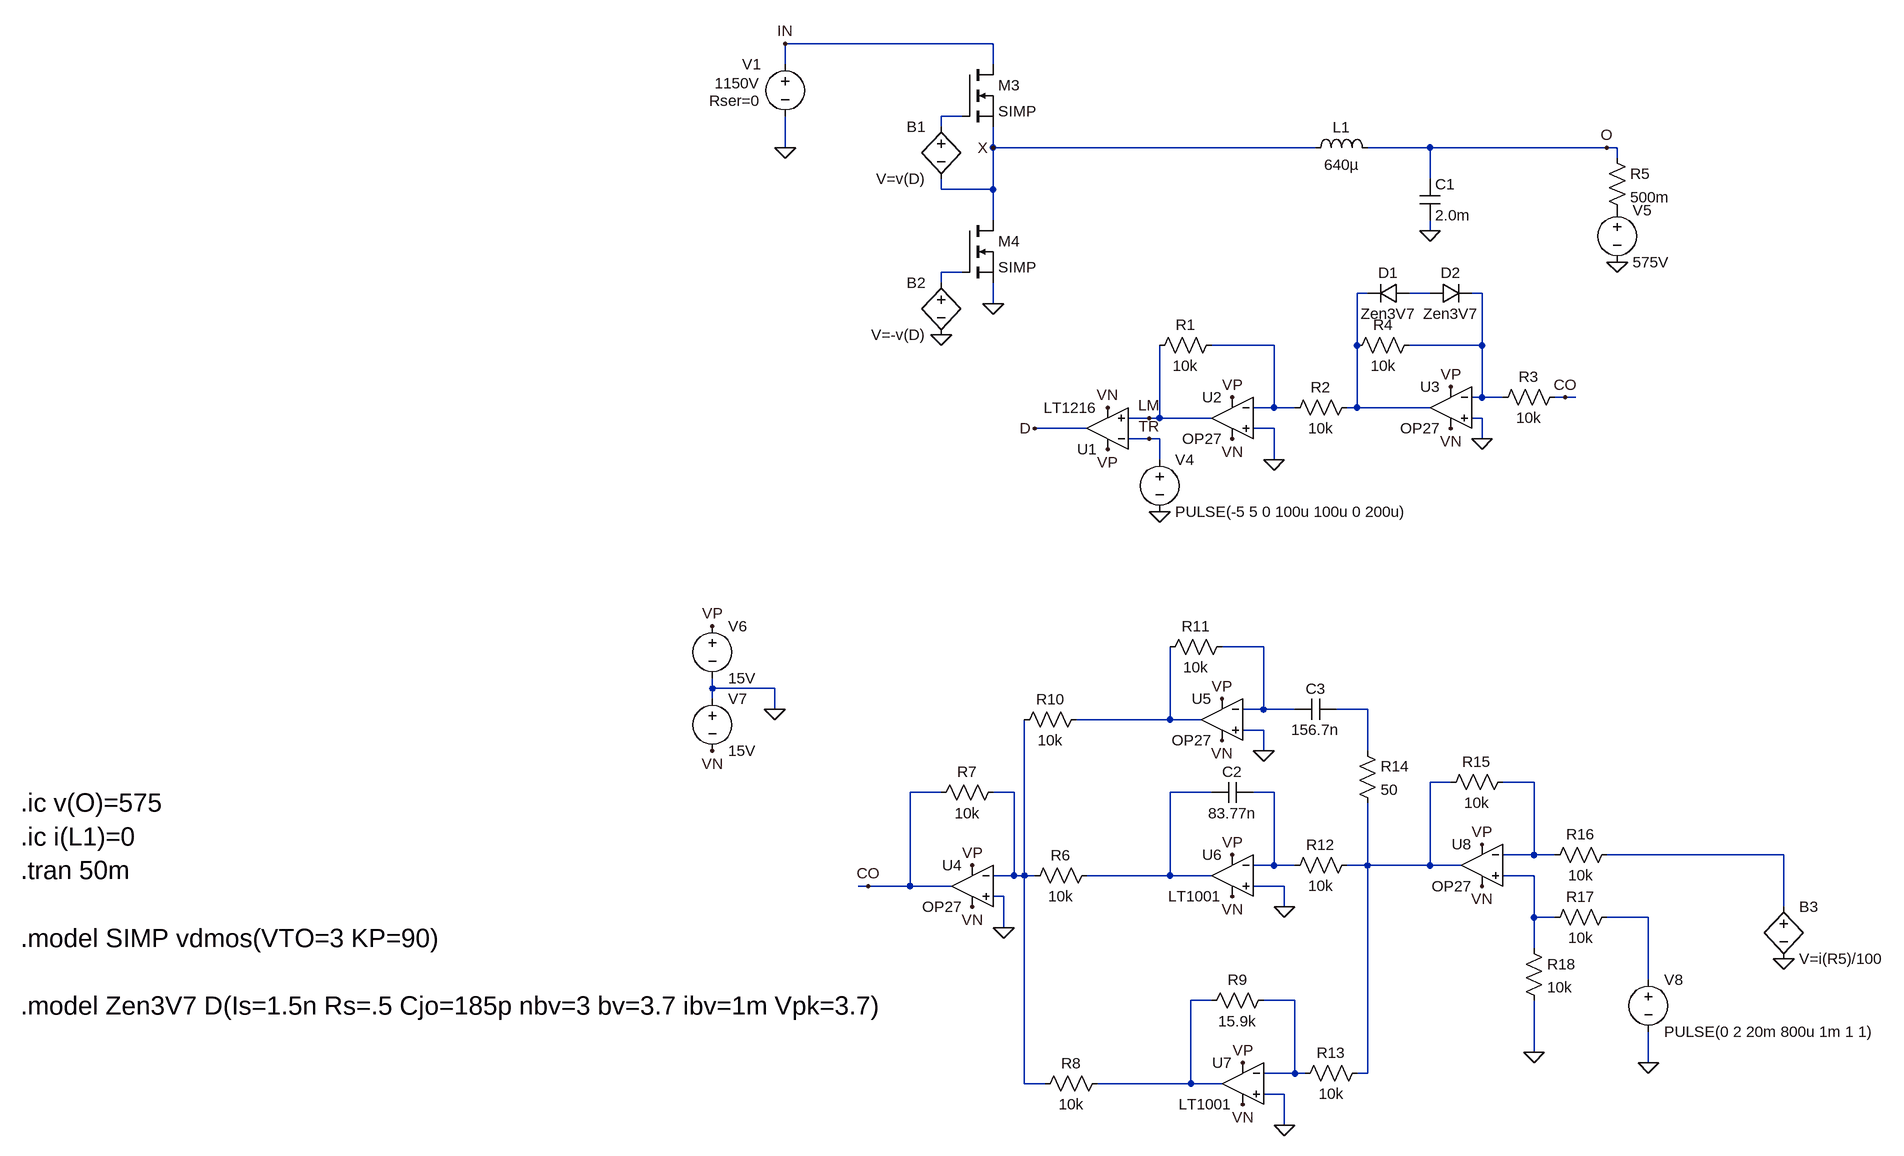
[diagram p0: schematic Analog PID Controller - 575V Pack.asc]
Analog PID Controller - 575V Pack.asc, the LTspice schematic file:
Version 4
SHEET 1 2304 1776
WIRE 704 64 384 64
WIRE 384 96 384 64
WIRE 704 96 704 64
WIRE 656 176 624 176
WIRE 624 192 624 176
WIRE 384 224 384 176
WIRE 704 224 704 192
WIRE 1200 224 704 224
WIRE 1376 224 1280 224
WIRE 1648 224 1376 224
WIRE 1664 224 1648 224
WIRE 1664 240 1664 224
WIRE 1376 272 1376 224
WIRE 624 288 624 272
WIRE 704 288 704 224
WIRE 704 288 624 288
WIRE 704 336 704 288
WIRE 1376 352 1376 336
WIRE 656 416 624 416
WIRE 624 432 624 416
WIRE 1280 448 1264 448
WIRE 1376 448 1344 448
WIRE 1456 448 1440 448
WIRE 704 464 704 432
WIRE 1136 528 1040 528
WIRE 1264 528 1264 448
WIRE 1456 528 1456 448
WIRE 1456 528 1344 528
WIRE 1456 608 1456 528
WIRE 1456 608 1440 608
WIRE 1488 608 1456 608
WIRE 1584 608 1568 608
WIRE 1600 608 1584 608
WIRE 1136 624 1136 528
WIRE 1136 624 1104 624
WIRE 1168 624 1136 624
WIRE 1264 624 1264 528
WIRE 1264 624 1248 624
WIRE 1376 624 1264 624
WIRE 944 640 912 640
WIRE 960 640 960 528
WIRE 960 640 944 640
WIRE 1040 640 960 640
WIRE 1456 640 1440 640
WIRE 848 656 768 656
WIRE 1136 656 1104 656
WIRE 944 672 912 672
WIRE 960 672 944 672
WIRE 1456 672 1456 640
WIRE 960 704 960 672
WIRE 1136 704 1136 656
WIRE 1120 992 1056 992
WIRE 272 1056 272 1040
WIRE 368 1056 272 1056
WIRE 272 1072 272 1056
WIRE 368 1088 368 1056
WIRE 1120 1088 1120 992
WIRE 1120 1088 1088 1088
WIRE 1168 1088 1120 1088
WIRE 1280 1088 1232 1088
WIRE 976 1104 976 992
WIRE 976 1104 832 1104
WIRE 1024 1104 976 1104
WIRE 1120 1120 1088 1120
WIRE 1120 1152 1120 1120
WIRE 1280 1152 1280 1088
WIRE 1408 1200 1376 1200
WIRE 1536 1200 1488 1200
WIRE 624 1216 576 1216
WIRE 736 1216 704 1216
WIRE 1040 1216 976 1216
WIRE 1136 1216 1104 1216
WIRE 1536 1312 1536 1200
WIRE 1536 1312 1488 1312
WIRE 1568 1312 1536 1312
WIRE 1920 1312 1648 1312
WIRE 1136 1328 1136 1216
WIRE 1136 1328 1104 1328
WIRE 1168 1328 1136 1328
WIRE 1280 1328 1280 1232
WIRE 1280 1328 1248 1328
WIRE 1376 1328 1376 1200
WIRE 1376 1328 1280 1328
WIRE 1424 1328 1376 1328
WIRE 736 1344 736 1216
WIRE 736 1344 704 1344
WIRE 752 1344 752 1104
WIRE 752 1344 736 1344
WIRE 768 1344 752 1344
WIRE 976 1344 976 1216
WIRE 976 1344 848 1344
WIRE 1040 1344 976 1344
WIRE 1536 1344 1488 1344
WIRE 512 1360 496 1360
WIRE 576 1360 576 1216
WIRE 576 1360 512 1360
WIRE 640 1360 576 1360
WIRE 1152 1360 1104 1360
WIRE 720 1376 704 1376
WIRE 1152 1392 1152 1360
WIRE 1920 1392 1920 1312
WIRE 1536 1408 1536 1344
WIRE 1568 1408 1536 1408
WIRE 1712 1408 1648 1408
WIRE 720 1424 720 1376
WIRE 1536 1456 1536 1408
WIRE 1712 1504 1712 1408
WIRE 1040 1536 1008 1536
WIRE 1168 1536 1120 1536
WIRE 1536 1616 1536 1536
WIRE 1712 1632 1712 1584
WIRE 1168 1648 1168 1536
WIRE 1168 1648 1120 1648
WIRE 1184 1648 1168 1648
WIRE 1280 1648 1280 1328
WIRE 1280 1648 1264 1648
WIRE 752 1664 752 1344
WIRE 784 1664 752 1664
WIRE 1008 1664 1008 1536
WIRE 1008 1664 864 1664
WIRE 1056 1664 1008 1664
WIRE 1152 1680 1120 1680
WIRE 1152 1728 1152 1680
FLAG 624 512 0
FLAG 704 464 0
FLAG 384 224 0
FLAG 1376 352 0
FLAG 960 784 0
FLAG 1664 400 0
FLAG 1456 672 0
FLAG 880 624 VN
FLAG 1072 672 VN
FLAG 880 688 VP
FLAG 1072 608 VP
FLAG 1408 656 VN
FLAG 1408 592 VP
FLAG 1584 608 CO
FLAG 1648 224 O
FLAG 768 656 D
FLAG 368 1088 0
FLAG 272 960 VP
FLAG 272 1152 VN
FLAG 1120 1152 0
FLAG 1152 1392 0
FLAG 1152 1728 0
FLAG 1920 1472 0
FLAG 1712 1632 0
FLAG 1536 1616 0
FLAG 512 1360 CO
FLAG 1088 1696 VN
FLAG 1072 1376 VN
FLAG 1056 1136 VN
FLAG 1456 1360 VN
FLAG 1072 1312 VP
FLAG 1456 1296 VP
FLAG 1056 1072 VP
FLAG 1088 1632 VP
FLAG 672 1328 VP
FLAG 672 1392 VN
FLAG 704 224 X
FLAG 384 64 IN
FLAG 1136 704 0
FLAG 944 672 TR
FLAG 944 640 LM
FLAG 720 1424 0
DATAFLAG 960 784 ""
SYMBOL voltage 384 80 M0
WINDOW 3 39 45 Left 2
WINDOW 123 0 0 Left 0
WINDOW 39 38 72 Left 2
WINDOW 0 37 16 Left 2
SYMATTR Value 1150V
SYMATTR SpiceLine Rser=0
SYMATTR InstName V1
SYMBOL ind 1184 240 R270
WINDOW 0 32 56 VTop 2
WINDOW 3 5 56 VBottom 2
SYMATTR InstName L1
SYMATTR Value 640µ
SYMBOL cap 1360 272 R0
SYMATTR InstName C1
SYMATTR Value 2.0m
SYMBOL OpAmps\\LT1216 880 720 R180
SYMATTR InstName U1
SYMBOL OpAmps\\OP27 1072 576 M0
SYMATTR InstName U2
SYMBOL res 1056 512 R90
WINDOW 0 0 56 VBottom 2
WINDOW 3 32 56 VTop 2
SYMATTR InstName R1
SYMATTR Value 10k
SYMBOL voltage 960 688 R0
WINDOW 123 0 0 Left 0
WINDOW 39 0 0 Left 0
SYMATTR InstName V4
SYMATTR Value PULSE(-5 5 0 100u 100u 0 200u)
SYMBOL res 1264 608 R90
WINDOW 0 0 56 VBottom 2
WINDOW 3 32 56 VTop 2
SYMATTR InstName R2
SYMATTR Value 10k
SYMBOL OpAmps\\OP27 1408 560 M0
SYMATTR InstName U3
SYMBOL res 1584 592 R90
WINDOW 0 0 56 VBottom 2
WINDOW 3 32 56 VTop 2
SYMATTR InstName R3
SYMATTR Value 10k
SYMBOL res 1360 512 R90
WINDOW 0 0 56 VBottom 2
WINDOW 3 32 56 VTop 2
SYMATTR InstName R4
SYMATTR Value 10k
SYMBOL diode 1344 432 R90
WINDOW 0 0 32 VBottom 2
WINDOW 3 32 32 VTop 2
SYMATTR InstName D1
SYMATTR Value Zen3V7
SYMBOL diode 1376 432 M90
WINDOW 0 0 32 VBottom 2
WINDOW 3 32 32 VTop 2
SYMATTR InstName D2
SYMATTR Value Zen3V7
SYMBOL res 1648 224 R0
SYMATTR InstName R5
SYMATTR Value 500m
SYMBOL voltage 1664 304 R0
WINDOW 123 0 0 Left 0
WINDOW 39 0 0 Left 0
SYMATTR InstName V5
SYMATTR Value 575V
SYMBOL voltage 272 944 R0
WINDOW 123 0 0 Left 0
WINDOW 39 0 0 Left 0
SYMATTR InstName V6
SYMATTR Value 15V
SYMBOL voltage 272 1056 R0
WINDOW 123 0 0 Left 0
WINDOW 39 0 0 Left 0
SYMATTR InstName V7
SYMATTR Value 15V
SYMBOL OpAmps\\OP27 672 1296 M0
SYMATTR InstName U4
SYMBOL OpAmps\\OP27 1056 1040 M0
SYMATTR InstName U5
SYMBOL OpAmps\\OP27 1456 1264 M0
SYMATTR InstName U8
SYMBOL res 864 1328 R90
WINDOW 0 0 56 VBottom 2
WINDOW 3 32 56 VTop 2
SYMATTR InstName R6
SYMATTR Value 10k
SYMBOL res 720 1200 R90
WINDOW 0 0 56 VBottom 2
WINDOW 3 32 56 VTop 2
SYMATTR InstName R7
SYMATTR Value 10k
SYMBOL res 880 1648 R90
WINDOW 0 0 56 VBottom 2
WINDOW 3 32 56 VTop 2
SYMATTR InstName R8
SYMATTR Value 10k
SYMBOL res 1136 1520 R90
WINDOW 0 0 56 VBottom 2
WINDOW 3 32 56 VTop 2
SYMATTR InstName R9
SYMATTR Value 15.9k
SYMBOL res 848 1088 R90
WINDOW 0 0 56 VBottom 2
WINDOW 3 32 56 VTop 2
SYMATTR InstName R10
SYMATTR Value 10k
SYMBOL res 1072 976 R90
WINDOW 0 0 56 VBottom 2
WINDOW 3 32 56 VTop 2
SYMATTR InstName R11
SYMATTR Value 10k
SYMBOL cap 1104 1200 R90
WINDOW 0 0 32 VBottom 2
WINDOW 3 32 32 VTop 2
SYMATTR InstName C2
SYMATTR Value 83.77n
SYMBOL res 1264 1312 R90
WINDOW 0 0 56 VBottom 2
WINDOW 3 32 56 VTop 2
SYMATTR InstName R12
SYMATTR Value 10k
SYMBOL res 1280 1632 R90
WINDOW 0 0 56 VBottom 2
WINDOW 3 32 56 VTop 2
SYMATTR InstName R13
SYMATTR Value 10k
SYMBOL cap 1232 1072 R90
WINDOW 0 0 32 VBottom 2
WINDOW 3 32 32 VTop 2
SYMATTR InstName C3
SYMATTR Value 156.7n
SYMBOL res 1264 1136 R0
SYMATTR InstName R14
SYMATTR Value 50
SYMBOL res 1504 1184 R90
WINDOW 0 0 56 VBottom 2
WINDOW 3 32 56 VTop 2
SYMATTR InstName R15
SYMATTR Value 10k
SYMBOL res 1664 1296 R90
WINDOW 0 0 56 VBottom 2
WINDOW 3 32 56 VTop 2
SYMATTR InstName R16
SYMATTR Value 10k
SYMBOL res 1664 1392 R90
WINDOW 0 0 56 VBottom 2
WINDOW 3 32 56 VTop 2
SYMATTR InstName R17
SYMATTR Value 10k
SYMBOL voltage 1712 1488 R0
WINDOW 123 0 0 Left 0
WINDOW 39 0 0 Left 0
SYMATTR InstName V8
SYMATTR Value PULSE(0 2 20m 800u 1m 1 1)
SYMBOL res 1520 1440 R0
SYMATTR InstName R18
SYMATTR Value 10k
SYMBOL OpAmps\\LT1001 1072 1280 M0
SYMATTR InstName U6
SYMBOL OpAmps\\LT1001 1088 1600 M0
SYMATTR InstName U7
SYMBOL nmos 656 96 R0
SYMATTR InstName M3
SYMATTR Value SIMP
SYMBOL nmos 656 336 R0
SYMATTR InstName M4
SYMATTR Value SIMP
SYMBOL bv 624 176 M0
SYMATTR InstName B1
SYMATTR Value V=v(D)
SYMBOL bv 624 416 M0
SYMATTR InstName B2
SYMATTR Value V=-v(D)
SYMBOL bv 1920 1376 R0
SYMATTR InstName B3
SYMATTR Value V=i(R5)/100
TEXT -792 1232 Left 4 !.ic v(O)=575\n.ic i(L1)=0\n.tran 50m\n \n.model SIMP vdmos(VTO=3 KP=90)\n \n.model Zen3V7 D(Is=1.5n Rs=.5 Cjo=185p nbv=3 bv=3.7 ibv=1m Vpk=3.7)

The netlist it stands for:
* Analog PID Controller - 575V Pack.asc
V1 IN 0 1150V Rser=0
L1 X O 640µ
C1 O 0 2.0m
XU1 LM TR VP VN D LT1216  ; pins In+ In- V+ V- OUT
XU2 0 N006 VP VN LM OP27  ; pins In+ In- V+ V- OUT
R1 N006 LM 10k
V4 TR 0 PULSE(-5 5 0 100u 100u 0 200u)
R2 N003 N006 10k
XU3 0 N005 VP VN N003 OP27  ; pins In+ In- V+ V- OUT
R3 CO N005 10k
R4 N005 N003 10k
D1 N004 N003 Zen3V7
D2 N004 N005 Zen3V7
R5 O P001 500m
V5 P001 0 575V
V6 VP 0 15V
V7 0 VN 15V
XU4 0 N012 VP VN CO OP27  ; pins In+ In- V+ V- OUT
XU5 0 N007 VP VN N009 OP27  ; pins In+ In- V+ V- OUT
XU8 N016 N011 VP VN N010 OP27  ; pins In+ In- V+ V- OUT
R6 N013 N012 10k
R7 N012 CO 10k
R8 N018 N012 10k
R9 N019 N018 15.9k
R10 N009 N012 10k
R11 N007 N009 10k
C2 N014 N013 83.77n
R12 N010 N014 10k
R13 N010 N019 10k
C3 N008 N007 156.7n
R14 N008 N010 50
R15 N011 N010 10k
R16 N015 N011 10k
R17 N017 N016 10k
V8 N017 0 PULSE(0 2 20m 800u 1m 1 1)
R18 N016 0 10k
XU6 0 N014 VP VN N013 LT1001  ; pins In+ In- V+ V- OUT
XU7 0 N019 VP VN N018 LT1001  ; pins In+ In- V+ V- OUT
M3 IN N001 X X SIMP
M4 X N002 0 0 SIMP
B1 N001 X V=v(D)
B2 N002 0 V=-v(D)
B3 N015 0 V=i(R5)/100
.model D D
.lib standard.dio
.model NMOS NMOS
.model PMOS PMOS
.lib standard.mos
.ic v(O)=575
.ic i(L1)=0
.tran 50m
.model SIMP vdmos(VTO=3 KP=90)
.model Zen3V7 D(Is=1.5n Rs=.5 Cjo=185p nbv=3 bv=3.7 ibv=1m Vpk=3.7)
.lib ADI.lib
.lib LTC.lib
.backanno
.end